# EAGLE board reg-board-1 (EAGLE 7.7.0), part 1 of 2
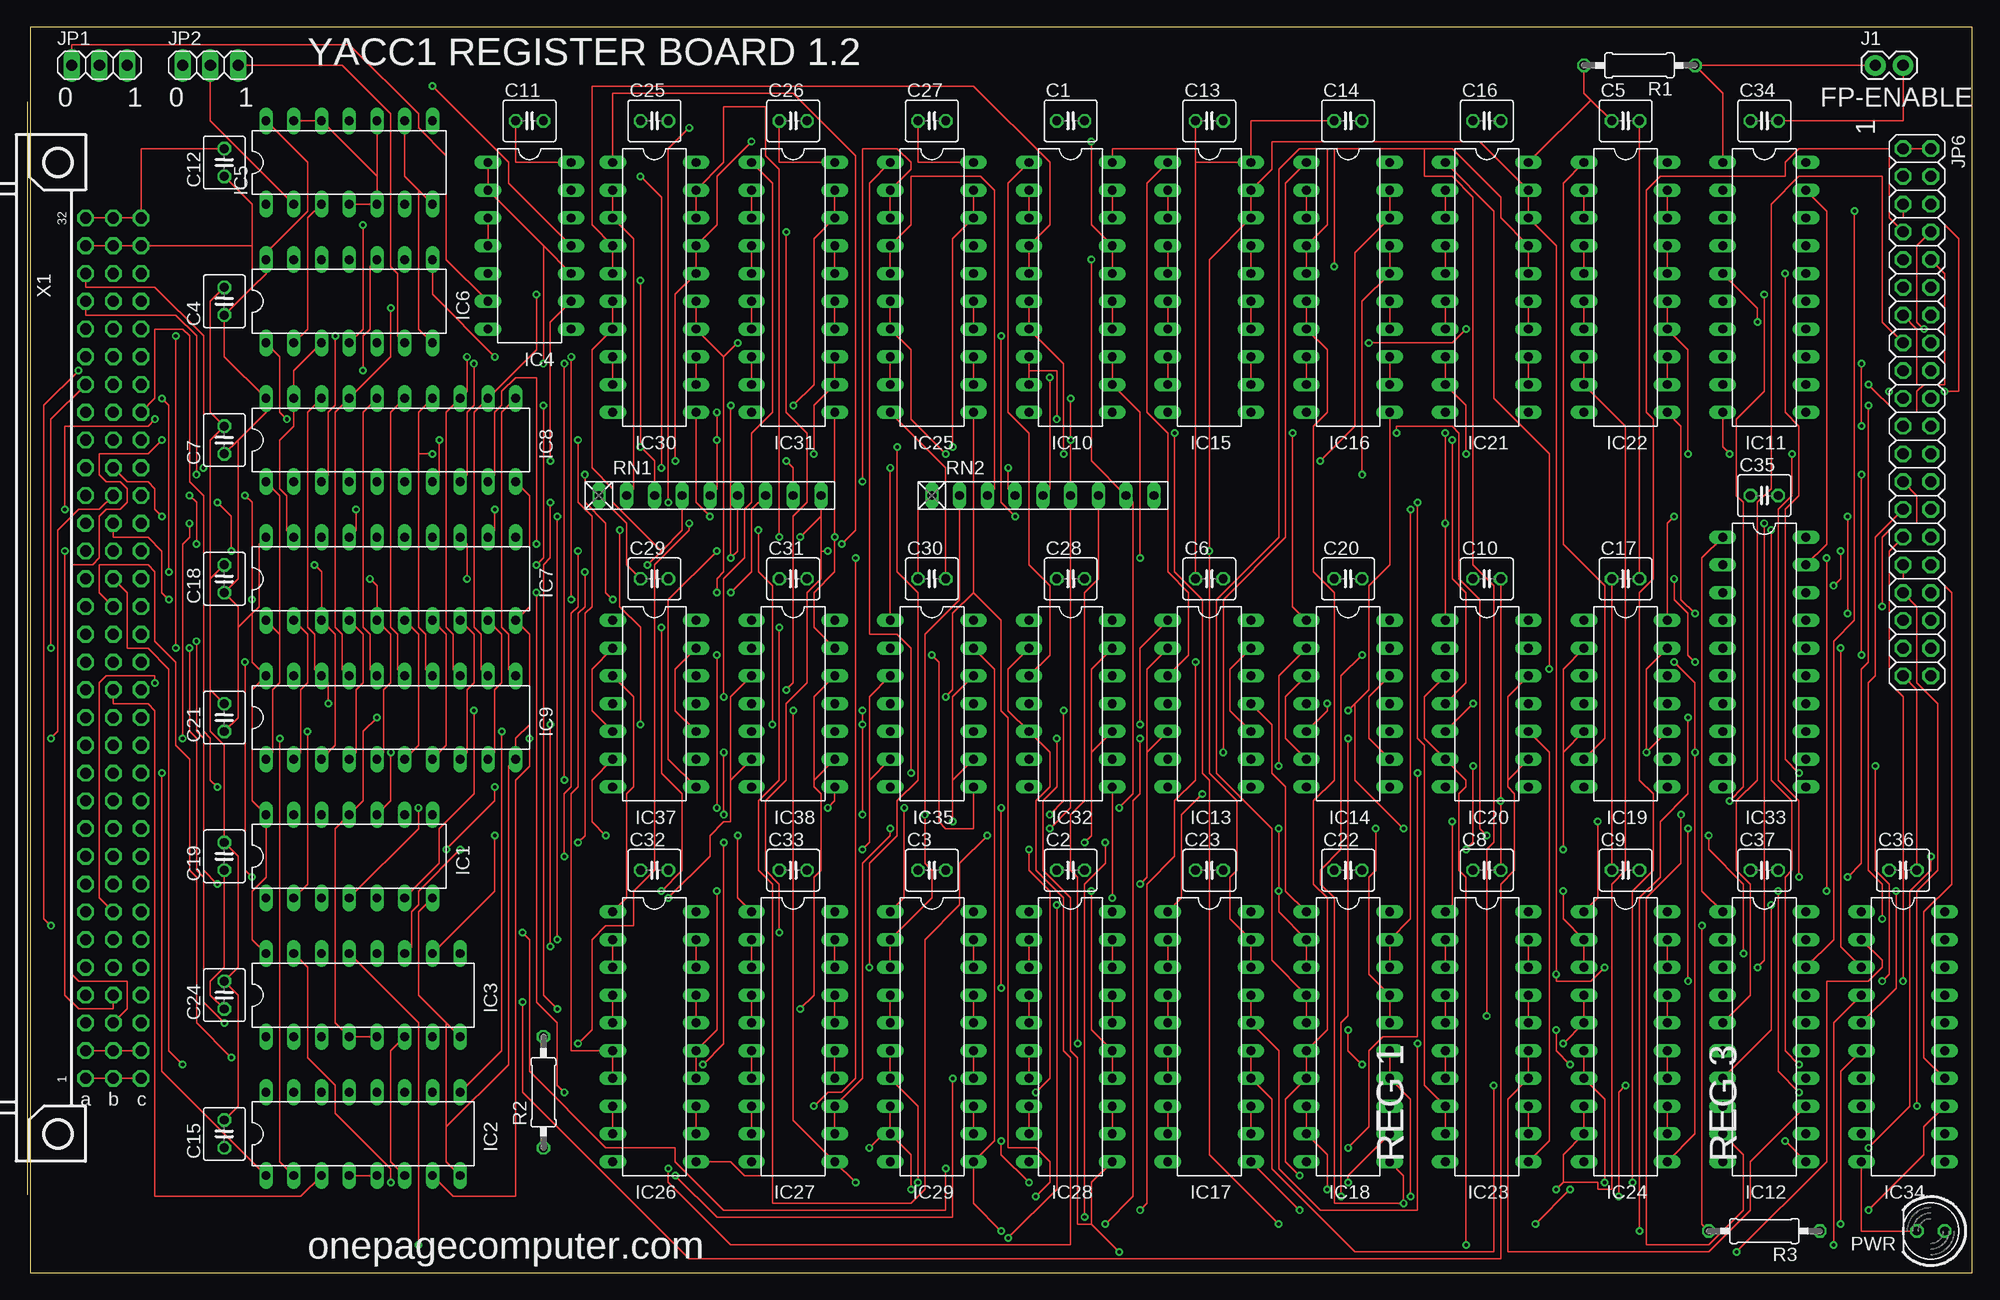
[diagram p5: board, top side]
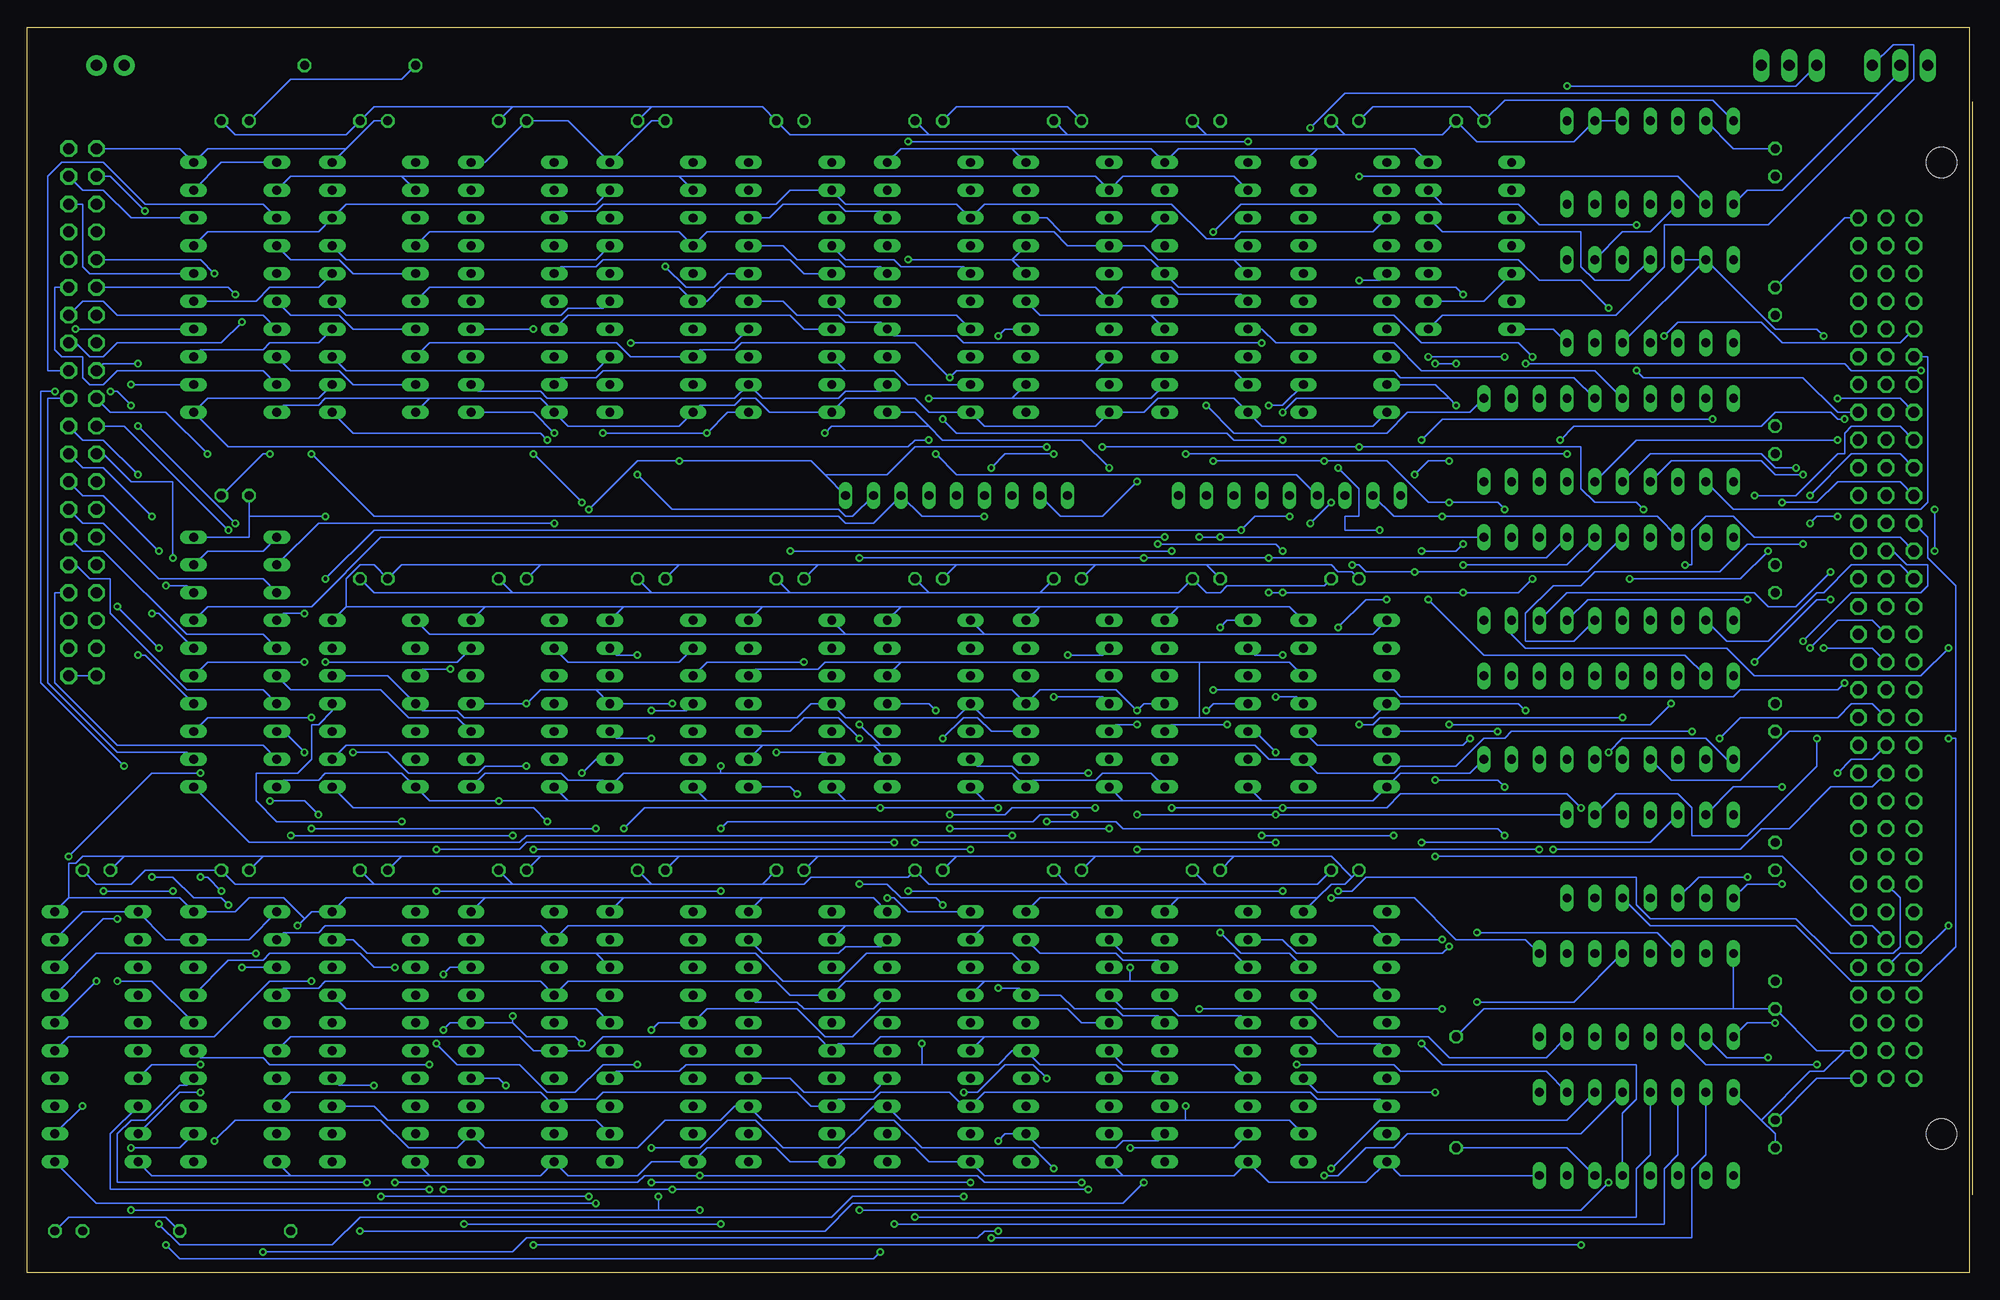
[diagram p6: board, bottom side, seen from below]

Size 177.78 x 113.97 mm. Coordinates in mm from the lower left corner, seen from the top.
Outline: 0,0 177.78,0 177.78,113.97 0,113.97 0,0
Copper layers (1*16): Top 0.0356mm / dielectric 1.5011mm / Bottom 0.0356mm
Design rules "LaenPCBOrder *": minimum track width 6mil, minimum drill 13mil, track to track 8mil, track to pad 8mil, pad to pad 8mil, via to via 8mil, smd to smd 6mil, copper to edge 40mil, drill to drill 8mil, minimum pad ring 7mil, minimum via ring 7mil, stop-mask expansion 3mil, vias tented up to drill 0mil, thermal gap 10mil
Net classes: 1 GND: width 1 mm; 2 5V: width 1 mm

## Footprints (pad centres in the part's own frame; a part is rotated, then mirrored left to right if it is on the bottom)
C025-040X050 = drill 0.813 octagon: 1 -1.27,0; 2 1.27,0
DIL14 = drill 0.813 long: 1 -7.62,-3.81; 2 -5.08,-3.81; 3 -2.54,-3.81; 4 0,-3.81; 5 2.54,-3.81; 6 5.08,-3.81; 7 7.62,-3.81; 8 7.62,3.81; 9 5.08,3.81; 10 2.54,3.81; 11 0,3.81; 12 -2.54,3.81; 13 -5.08,3.81; 14 -7.62,3.81
DIL16 = drill 0.813 long: 1 -8.89,-3.81; 2 -6.35,-3.81; 3 -3.81,-3.81; 4 -1.27,-3.81; 5 1.27,-3.81; 6 3.81,-3.81; 7 6.35,-3.81; 8 8.89,-3.81; 9 8.89,3.81; 10 6.35,3.81; 11 3.81,3.81; 12 1.27,3.81; 13 -1.27,3.81; 14 -3.81,3.81; 15 -6.35,3.81; 16 -8.89,3.81
DIL20 = drill 0.813 long: 1 -11.43,-3.81; 2 -8.89,-3.81; 3 -6.35,-3.81; 4 -3.81,-3.81; 5 -1.27,-3.81; 6 1.27,-3.81; 7 3.81,-3.81; 8 6.35,-3.81; 9 8.89,-3.81; 10 11.43,-3.81; 11 11.43,3.81; 12 8.89,3.81; 13 6.35,3.81; 14 3.81,3.81; 15 1.27,3.81; 16 -1.27,3.81; 17 -3.81,3.81; 18 -6.35,3.81; 19 -8.89,3.81; 20 -11.43,3.81
1X02 = drill 1.016 pad 1.88: 1 0,0; 2 2.54,0
1X03 = drill 1.016 long: 1 -2.54,0; 2 0,0; 3 2.54,0
2X20 = drill 1.016 octagon: 1 -24.13,-1.27; 2 -24.13,1.27; 3 -21.59,-1.27; 4 -21.59,1.27; 5 -19.05,-1.27; 6 -19.05,1.27; 7 -16.51,-1.27; 8 -16.51,1.27; 9 -13.97,-1.27; 10 -13.97,1.27; 11 -11.43,-1.27; 12 -11.43,1.27; 13 -8.89,-1.27; 14 -8.89,1.27; 15 -6.35,-1.27; 16 -6.35,1.27; 17 -3.81,-1.27; 18 -3.81,1.27; 19 -1.27,-1.27; 20 -1.27,1.27; 21 1.27,-1.27; 22 1.27,1.27; 23 3.81,-1.27; 24 3.81,1.27; 25 6.35,-1.27; 26 6.35,1.27; 27 8.89,-1.27; 28 8.89,1.27; 29 11.43,-1.27; 30 11.43,1.27; 31 13.97,-1.27; 32 13.97,1.27; 33 16.51,-1.27; 34 16.51,1.27; 35 19.05,-1.27; 36 19.05,1.27; 37 21.59,-1.27; 38 21.59,1.27; 39 24.13,-1.27; 40 24.13,1.27
LED5MM = drill 0.813 octagon: A -1.27,0; K 1.27,0
0207/10 = drill 0.813 octagon: 1 -5.08,0; 2 5.08,0
RN-9 = drill 0.813 long: 1 -10.16,0; 2 -7.62,0; 3 -5.08,0; 4 -2.54,0; 5 0,0; 6 2.54,0; 7 5.08,0; 8 7.62,0; 9 10.16,0
FABC96R = drill 1.016 octagon: A1 -2.54,39.37; A2 -2.54,36.83; A3 -2.54,34.29; A4 -2.54,31.75; A5 -2.54,29.21; A6 -2.54,26.67; A7 -2.54,24.13; A8 -2.54,21.59; A9 -2.54,19.05; A10 -2.54,16.51; A11 -2.54,13.97; A12 -2.54,11.43; A13 -2.54,8.89; A14 -2.54,6.35; A15 -2.54,3.81; A16 -2.54,1.27; A17 -2.54,-1.27; A18 -2.54,-3.81; A19 -2.54,-6.35; A20 -2.54,-8.89; A21 -2.54,-11.43; A22 -2.54,-13.97; A23 -2.54,-16.51; A24 -2.54,-19.05; A25 -2.54,-21.59; A26 -2.54,-24.13; A27 -2.54,-26.67; A28 -2.54,-29.21; A29 -2.54,-31.75; A30 -2.54,-34.29; A31 -2.54,-36.83; A32 -2.54,-39.37; B1 -5.08,39.37; B2 -5.08,36.83; B3 -5.08,34.29; B4 -5.08,31.75; B5 -5.08,29.21; B6 -5.08,26.67; B7 -5.08,24.13; B8 -5.08,21.59; B9 -5.08,19.05; B10 -5.08,16.51; B11 -5.08,13.97; B12 -5.08,11.43; B13 -5.08,8.89; B14 -5.08,6.35; B15 -5.08,3.81; B16 -5.08,1.27; B17 -5.08,-1.27; B18 -5.08,-3.81; B19 -5.08,-6.35; B20 -5.08,-8.89; B21 -5.08,-11.43; B22 -5.08,-13.97; B23 -5.08,-16.51; B24 -5.08,-19.05; B25 -5.08,-21.59; B26 -5.08,-24.13; B27 -5.08,-26.67; B28 -5.08,-29.21; B29 -5.08,-31.75; B30 -5.08,-34.29; B31 -5.08,-36.83; B32 -5.08,-39.37; C1 -7.62,39.37; C2 -7.62,36.83; C3 -7.62,34.29; C4 -7.62,31.75; C5 -7.62,29.21; C6 -7.62,26.67; C7 -7.62,24.13; C8 -7.62,21.59; C9 -7.62,19.05; C10 -7.62,16.51; C11 -7.62,13.97; C12 -7.62,11.43; C13 -7.62,8.89; C14 -7.62,6.35; C15 -7.62,3.81; C16 -7.62,1.27; C17 -7.62,-1.27; C18 -7.62,-3.81; C19 -7.62,-6.35; C20 -7.62,-8.89; C21 -7.62,-11.43; C22 -7.62,-13.97; C23 -7.62,-16.51; C24 -7.62,-19.05; C25 -7.62,-21.59; C26 -7.62,-24.13; C27 -7.62,-26.67; C28 -7.62,-29.21; C29 -7.62,-31.75; C30 -7.62,-34.29; C31 -7.62,-36.83; C32 -7.62,-39.37 | hole 2.794: 0,-44.456; 0,44.456

## Placement (x,y rotation side)
C1  [C025-040X050]  95.25,105.41 0 top
C2  [C025-040X050]  95.25,36.83 0 top
C3  [C025-040X050]  82.55,36.83 0 top
C4  [C025-040X050]  17.78,88.9 90 top
C5  [C025-040X050]  146.05,105.41 0 top
C6  [C025-040X050]  107.95,63.5 0 top
C7  [C025-040X050]  17.78,76.2 90 top
C8  [C025-040X050]  133.35,36.83 0 top
C9  [C025-040X050]  146.05,36.83 0 top
C10  [C025-040X050]  133.35,63.5 0 top
C11  [C025-040X050]  45.72,105.41 0 top
C12  [C025-040X050]  17.78,101.6 90 top
C13  [C025-040X050]  107.95,105.41 0 top
C14  [C025-040X050]  120.65,105.41 0 top
C15  [C025-040X050]  17.78,12.7 90 top
C16  [C025-040X050]  133.35,105.41 0 top
C17  [C025-040X050]  146.05,63.5 0 top
C18  [C025-040X050]  17.78,63.5 90 top
C19  [C025-040X050]  17.78,38.1 90 top
C20  [C025-040X050]  120.65,63.5 0 top
C21  [C025-040X050]  17.78,50.8 90 top
C22  [C025-040X050]  120.65,36.83 0 top
C23  [C025-040X050]  107.95,36.83 0 top
C24  [C025-040X050]  17.78,25.4 90 top
C25  [C025-040X050]  57.15,105.41 0 top
C26  [C025-040X050]  69.85,105.41 0 top
C27  [C025-040X050]  82.55,105.41 0 top
C28  [C025-040X050]  95.25,63.5 0 top
C29  [C025-040X050]  57.15,63.5 0 top
C30  [C025-040X050]  82.55,63.5 0 top
C31  [C025-040X050]  69.85,63.5 0 top
C32  [C025-040X050]  57.15,36.83 0 top
C33  [C025-040X050]  69.85,36.83 0 top
C34  [C025-040X050]  158.75,105.41 0 top
C35  [C025-040X050]  158.75,71.12 0 top
C36  [C025-040X050]  171.45,36.83 0 top
C37  [C025-040X050]  158.75,36.83 0 top
IC1  74LS04N  [DIL14]  29.21,38.1 0 top
IC2  74LS138N  [DIL16]  30.48,12.7 0 top
IC3  74LS138N  [DIL16]  30.48,25.4 0 top
IC4  74LS00N  [DIL14]  45.72,93.98 270 top
IC5  74LS86N  [DIL14]  29.21,101.6 0 top
IC6  74LS00N  [DIL14]  29.21,88.9 0 top
IC7  74LS245N  [DIL20]  33.02,63.5 0 top
IC8  74LS245N  [DIL20]  33.02,76.2 0 top
IC9  74LS245N  [DIL20]  33.02,50.8 0 top
IC10  74S374N  [DIL20]  95.25,90.17 270 top
IC11  74LS244N  [DIL20]  158.75,90.17 270 top
IC12  74LS244N  [DIL20]  158.75,21.59 270 top
IC13  7432N  [DIL14]  107.95,52.07 270 top
IC14  74LS02N  [DIL14]  120.65,52.07 270 top
IC15  74S374N  [DIL20]  107.95,90.17 270 top
IC16  74S374N  [DIL20]  120.65,90.17 270 top
IC17  74S374N  [DIL20]  107.95,21.59 270 top
IC18  74S374N  [DIL20]  120.65,21.59 270 top
IC19  7432N  [DIL14]  146.05,52.07 270 top
IC20  74LS02N  [DIL14]  133.35,52.07 270 top
IC21  74S374N  [DIL20]  133.35,90.17 270 top
IC22  74S374N  [DIL20]  146.05,90.17 270 top
IC23  74S374N  [DIL20]  133.35,21.59 270 top
IC24  74S374N  [DIL20]  146.05,21.59 270 top
IC25  74S374N  [DIL20]  82.55,90.17 270 top
IC26  74S374N  [DIL20]  57.15,21.59 270 top
IC27  74S374N  [DIL20]  69.85,21.59 270 top
IC28  74S374N  [DIL20]  95.25,21.59 270 top
IC29  74S374N  [DIL20]  82.55,21.59 270 top
IC30  74S374N  [DIL20]  57.15,90.17 270 top
IC31  74S374N  [DIL20]  69.85,90.17 270 top
IC32  7432N  [DIL14]  95.25,52.07 270 top
IC33  74LS244N  [DIL20]  158.75,55.88 270 top
IC34  74LS244N  [DIL20]  171.45,21.59 270 top
IC35  74LS02N  [DIL14]  82.55,52.07 270 top
IC37  7432N  [DIL14]  57.15,52.07 270 top
IC38  74LS02N  [DIL14]  69.85,52.07 270 top
J1  [1X02]  168.91,110.49 0 top
JP1  [1X03]  6.35,110.49 0 top
JP2  [1X03]  16.51,110.49 0 top
JP6  [2X20]  172.72,78.74 270 top
PWR  l1  [LED5MM]  173.99,3.81 180 top
R1  10k  [0207/10]  147.32,110.49 180 top
R2  10k  [0207/10]  46.99,16.51 90 top
R3  330  [0207/10]  158.75,3.81 180 top
RN1  [RN-9]  62.23,71.12 0 top
RN2  [RN-9]  92.71,71.12 0 top
X1  FABC96R  [FABC96R]  2.54,57.15 180 top

## Tracks (layer width: path | path; a pad name or v marks a point on that pad's centre or on a via)
-R0-RDSEL  (via drill 0.33)
  Top 0.152: v89.53,3.17 93.98,7.62 v93.98,33.66 | v101.6,35.56 102.23,36.2 102.23,47.62 | IC13.5 102.23,47.62 | IC13.2 102.23,55.24 102.23,47.62
  Bottom 0.152: IC2.15 24.13,10.79 25.4,9.53 25.4,3.17 v89.53,3.17 | v93.98,33.66 94.61,34.29 97.79,34.29 99.06,35.56 v101.6,35.56
-R0-WRSEL  (via drill 0.33)
  Top 0.152: IC3.15 25.4,27.94 25.4,19.68 27.94,17.14 27.94,14.61 33.02,9.53 v33.02,8.26 | v101.6,5.71 102.23,6.35 102.23,35.56 104.78,38.1 104.78,43.18 106.68,45.09 v106.68,55.88 | IC14.6 114.94,48.9 114.94,52.7 IC14.3
  Bottom 0.152: v33.02,8.26 35.56,5.71 v101.6,5.71 | v106.68,55.88 115.57,55.88 IC14.3
-R1-RDSEL  (via drill 0.33)
  Top 0.152: v98.42,4.45 100.97,6.99 100.97,43.18 101.6,43.81 v101.6,48.9 | IC13.13 109.86,55.24 109.86,51.44 IC13.10
  Bottom 0.152: IC2.14 26.67,10.79 27.94,9.53 27.94,4.45 v98.42,4.45 | v101.6,48.9 103.5,50.8 106.68,50.8 107.95,49.53 IC13.10
-R1-WRSEL  (via drill 0.33)
  Top 0.152: v45.09,31.11 45.72,30.48 45.72,18.41 52.7,11.43 59.05,11.43 59.05,10.16 63.5,5.71 83.82,5.71 v83.82,9.53 | v120.65,11.43 122.56,13.34 122.56,20.32 123.83,21.59 127,21.59 v127,45.72 | IC14.12 122.56,52.7 122.56,48.9 IC14.9
  Bottom 0.152: IC3.14 28.57,31.11 v45.09,31.11 | v83.82,9.53 85.72,11.43 95.89,11.43 98.42,13.97 100.97,13.97 103.5,11.43 108.58,11.43 111.12,13.97 113.67,13.97 116.2,11.43 v120.65,11.43 | v127,45.72 125.73,46.99 IC14.9
-R2-RDSEL  (via drill 0.33)
  Top 0.152: v96.52,5.08 96.52,35.56 98.42,37.47 v98.42,39.37 | 140.34,47.62 v140.34,38.73 | IC19.5 140.34,47.62 | IC19.2 140.34,55.24 140.34,47.62
  Bottom 0.152: IC2.13 29.21,10.79 30.48,9.53 30.48,5.08 v96.52,5.08 | v98.42,39.37 132.08,39.37 132.72,38.73 v140.34,38.73
-R2-WRSEL  (via drill 0.33)
  Top 0.152: IC3.13 35.56,22.86 v35.56,2.54 | v131.44,2.54 131.44,36.2 130.81,36.83 130.81,43.81 131.44,44.45 131.44,45.09 IC20.6 127.64,48.9 127.64,52.7 IC20.3
  Bottom 0.152: v131.44,2.54 v35.56,2.54
-R3-RDSEL  (via drill 0.33)
  Top 0.152: v59.05,8.89 62.87,5.08 84.45,5.08 v84.45,17.78 | v92.08,16.51 93.34,17.78 93.34,34.92 91.44,36.83 v91.44,38.73 | v131.44,38.73 132.08,39.37 v132.08,46.35 | IC19.10 v147.96,47.62 147.96,55.24 IC19.13
  Bottom 0.152: IC2.12 35.56,12.7 51.44,12.7 52.7,11.43 55.24,11.43 57.78,8.89 v59.05,8.89 | v84.45,17.78 85.72,19.05 88.27,19.05 90.81,16.51 v92.08,16.51 | v131.44,38.73 v91.44,38.73 | v132.08,46.35 135.89,46.35 136.53,45.72 142.88,45.72 144.78,47.62 v147.96,47.62
-R3-WRSEL  (via drill 0.33)
  Top 0.152: v45.09,24.77 45.09,16.51 60.33,1.27 134.62,1.27 134.62,35.56 135.89,36.83 135.89,43.81 135.25,44.45 135.25,45.09 | IC20.9 135.25,45.09 | IC20.12 135.25,52.7 135.25,45.09
  Bottom 0.152: IC3.12 36.2,24.77 v45.09,24.77
-R4-RDSEL  (via drill 0.33)
  Top 0.152: v58.42,9.53 58.42,8.26 64.14,2.54 95.25,2.54 95.25,19.68 94.61,20.32 94.61,34.29 92.08,36.83 92.08,43.18 93.34,44.45 93.34,47.62 IC32.5 89.53,51.44 89.53,55.24 IC32.2
  Bottom 0.152: IC2.11 36.83,13.97 53.98,13.97 v58.42,9.53
-R4-WRSEL  (via drill 0.33)
  Top 0.152: IC3.11 34.92,29.84 34.92,33.02 35.56,33.66 35.56,34.92 v39.37,38.73 | v76.2,38.73 76.83,39.37 76.83,45.09 | IC35.6 76.83,45.09 | IC35.3 76.83,52.7 76.83,45.09
  Bottom 0.152: v76.2,38.73 v39.37,38.73
-R5-RDSEL  (via drill 0.33)
  Top 0.152: v61.59,19.05 63.5,20.95 v63.5,39.37 | v96.52,39.37 97.16,40.01 97.16,47.62 | IC32.10 97.16,47.62 | IC32.13 97.16,55.24 97.16,47.62
  Bottom 0.152: IC2.10 38.73,18.41 52.07,18.41 52.7,19.05 v61.59,19.05 | v96.52,39.37 v63.5,39.37
-R5-WRSEL  (via drill 0.33)
  Top 0.152: IC3.10 42.55,34.92 v42.55,40.01 | 84.45,45.09 v84.45,41.27 | IC35.9 84.45,45.09 | IC35.12 84.45,52.7 84.45,45.09
  Bottom 0.152: v42.55,40.01 43.18,40.64 77.47,40.64 78.11,41.27 v84.45,41.27
-R6-RDSEL  (via drill 0.33)
  Top 0.152: IC2.9 43.18,20.32 v43.18,49.53 | IC37.2 51.44,55.24 51.44,51.44 IC37.5
  Bottom 0.152: IC37.5 v43.18,49.53
-R6-WRSEL  (via drill 0.33)
  Top 0.152: v58.42,34.29 62.23,38.1 62.23,40.01 63.5,41.27 64.14,41.27 64.14,45.09 | IC38.6 64.14,45.09 | IC38.3 64.14,52.7 64.14,45.09
  Bottom 0.152: IC3.9 40.64,30.48 46.99,30.48 50.8,34.29 v58.42,34.29
-R7-RDSEL  (via drill 0.33)
  Top 0.152: IC2.7 38.73,6.99 44.45,6.99 44.45,45.09 45.72,46.35 v45.72,48.9 | IC37.13 59.05,55.24 59.05,51.44 IC37.10
  Bottom 0.152: v45.72,48.9 46.35,48.26 59.69,48.26 IC37.10
-R7-WRSEL  (via drill 0.33)
  Top 0.152: v70.48,24.13 71.75,25.4 71.75,36.2 72.39,36.83 72.39,43.81 71.75,44.45 71.75,45.09 | IC38.9 71.75,45.09 | IC38.12 71.75,52.7 71.75,45.09
  Bottom 0.152: IC3.7 38.73,19.68 47.62,19.68 49.53,21.59 57.78,21.59 60.33,24.13 v70.48,24.13
-RDSEL  (via drill 0.33)
  Top 0.152: IC2.5 IC2.4 | v50.16,20.95 51.44,22.23 51.44,30.48 52.7,31.75 55.24,31.75 55.24,34.92 57.15,36.83 57.15,64.77 60.33,67.94 v60.33,68.58 | v58.42,70.48 58.42,102.87 v60.33,104.78
  Bottom 0.152: IC5.1 20.32,99.06 17.14,99.06 8.26,107.95 | 8.26,107.95 6.35,109.86 JP1.2 | IC2.5 31.75,14.61 30.48,15.88 30.48,19.05 48.26,19.05 v50.16,20.95 | v58.42,70.48 v60.33,68.58 | v60.33,104.78 57.15,107.95 8.26,107.95
-RLDH  (via drill 0.33)
  Top 0.152: v63.5,47.62 v63.5,41.91 | v76.2,51.44 v76.2,50.16 v76.2,41.91 | IC14.5 118.75,51.44 v118.75,52.07 | v132.08,52.07 IC20.5
  Bottom 0.152: IC1.8 v63.5,41.91 v76.2,41.91 | v63.5,47.62 65.41,49.53 IC38.5 | IC35.5 78.11,50.16 v76.2,50.16 | IC38.11 75.56,52.07 v76.2,51.44 78.11,53.34 85.09,53.34 IC35.11 87.63,53.34 125.73,53.34 | v118.75,52.07 IC14.11 125.73,53.34 | IC20.11 v132.08,52.07 130.81,53.34 125.73,53.34
-RLDL  (via drill 0.33)
  Top 0.152: IC1.4 35.56,40.64 v35.56,42.55 | v73.03,42.55 73.66,43.18 IC38.8 | v62.87,42.55 v62.87,56.52 | v82.55,56.52 83.19,55.88 83.19,41.27 83.82,40.64 86.36,40.64 IC35.8 | IC14.2 114.3,54.61 v114.3,46.35
  Bottom 0.152: IC14.2 118.11,55.88 128.27,55.88 IC20.2 | IC20.8 135.89,45.72 128.91,45.72 128.27,45.09 125.09,45.09 IC14.8 123.19,45.72 114.3,45.72 | v35.56,42.55 36.83,43.81 52.07,43.81 53.34,42.55 v62.87,42.55 v73.03,42.55 | IC38.8 74.93,45.72 79.38,45.72 80.01,45.09 85.72,45.09 IC35.8 87.63,45.72 114.3,45.72 | IC38.2 65.41,56.52 v62.87,56.52 | IC35.2 79.38,56.52 v82.55,56.52 | 114.3,45.72 v114.3,46.35
-RRDH  (via drill 0.33)
  Top 0.152: IC1.6 37.47,37.47 37.47,40.64 40.64,43.81 v40.64,51.44
  Bottom 0.152: IC19.12 144.78,54.61 IC19.4 141.6,51.44 138.43,51.44 137.79,50.8 107.31,50.8 106.05,52.07 IC13.4 102.87,50.8 92.71,50.8 IC32.4 90.17,50.8 70.48,50.8 | v40.64,51.44 41.27,52.07 IC37.4 54.61,50.8 70.48,50.8 | IC37.12 62.23,55.88 70.48,55.88 | 97.79,55.88 70.48,55.88 | IC32.12 97.79,55.88 | IC13.12 111.12,55.24 105.41,55.24 104.78,55.88 97.79,55.88 | 70.48,55.88 70.48,50.8
-RRDL  (via drill 0.33)
  Top 0.152: IC1.2 25.4,35.56 v25.4,49.53 | IC13.1 101.6,57.15 v101.6,50.16
  Bottom 0.152: IC37.1 54.61,58.42 90.17,58.42 | IC32.1 90.17,58.42 | 102.87,58.42 IC13.1 | 90.17,58.42 102.87,58.42 | IC19.1 140.97,58.42 102.87,58.42 | v25.4,49.53 41.91,49.53 42.55,48.9 44.45,48.9 46.99,46.35 52.07,46.35 52.7,45.72 59.69,45.72 IC37.9 64.14,46.99 65.41,48.26 99.69,48.26 | 100.33,48.26 IC32.9 | 110.49,48.26 100.33,48.26 | IC13.9 110.49,48.26 | IC19.9 148.59,48.26 110.49,48.26 | 100.33,48.26 99.69,48.26 | 99.69,48.26 v101.6,50.16
-WRSEL  (via drill 0.33)
  Top 0.152: IC5.2 16.51,105.41 JP2.2 | IC3.5 IC3.4 27.94,22.86 27.94,40.64 IC1.11 30.48,43.18 30.48,49.53 v31.75,50.8 | v55.88,100.33 57.78,98.42 v57.78,73.66 | v53.98,67.94 53.98,60.96 55.88,59.05 v55.88,50.16
  Bottom 0.152: IC5.2 26.67,100.33 v55.88,100.33 | v57.78,73.66 55.88,71.75 55.88,69.22 57.15,69.22 57.15,67.94 v53.98,67.94 | v55.88,50.16 54.61,50.16 53.98,50.8 v31.75,50.8
ADATA0  (via drill 0.33)
  Top 0.152: IC23.2 IC23.3 | IC17.2 IC17.3 | IC26.2 IC26.3 | IC28.2 IC28.3 | IC21.2 IC21.3 | IC10.2 IC10.3 | IC15.2 IC15.3 | IC30.2 IC30.3 55.24,94.61 55.24,71.75 RN1.2 | v48.26,69.22 v48.26,30.48
  Bottom 0.152: IC12.2 154.31,31.11 151.13,31.11 150.5,31.75 130.81,31.75 IC23.2 128.27,31.75 102.87,31.75 | 90.17,31.75 54.61,31.75 IC26.2 v48.26,30.48 | IC28.2 90.17,31.75 | 102.87,31.75 IC17.2 | 90.17,31.75 102.87,31.75 | IC21.3 128.91,97.16 125.73,97.16 125.09,97.79 109.22,97.79 107.95,99.06 IC15.2 102.87,97.79 92.71,97.79 IC10.3 90.17,97.79 73.03,97.79 69.85,94.61 67.31,94.61 66.67,95.25 54.61,95.25 IC30.3 | IC7.18 28.57,69.22 v48.26,69.22 52.7,69.22 RN1.2
ADATA1  (via drill 0.33)
  Top 0.152: IC23.4 IC23.5 | IC17.4 IC17.5 | IC26.4 IC26.5 | IC28.4 IC28.5 | IC21.4 IC21.5 | IC10.5 IC10.4 93.34,95.89 93.34,101.6 86.36,108.58 51.44,108.58 51.44,95.89 IC30.4 IC30.5 | IC15.4 IC15.5 | IC7.17 29.84,67.94 v29.84,69.85 | RN1.3 57.15,74.3 v55.88,75.56 v55.88,90.81 | v76.83,27.94 76.83,37.47 79.38,40.01 79.38,43.18 81.28,45.09 81.28,62.23 79.38,64.14 v79.38,75.56
  Bottom 0.152: IC12.4 154.31,26.04 151.13,26.04 150.5,26.67 130.81,26.67 IC23.4 128.27,26.67 109.22,26.67 107.95,25.4 IC17.4 102.87,26.67 90.17,26.67 | IC26.4 54.61,26.67 76.83,26.67 | 90.17,26.67 76.83,26.67 | IC28.4 90.17,26.67 | IC10.5 92.08,92.08 97.79,92.08 98.42,92.71 102.87,92.71 IC15.4 | IC21.5 128.91,92.08 125.73,92.08 125.09,92.71 107.95,92.71 106.68,91.44 IC15.5 | v29.84,69.85 30.48,70.48 34.29,70.48 35.56,71.75 35.56,75.56 v55.88,75.56 v79.38,75.56 | IC30.5 53.98,90.81 v55.88,90.81 | v76.83,27.94 76.83,26.67
ADATA2  (via drill 0.33)
  Top 0.152: IC23.6 IC23.7 | IC17.6 IC17.7 | IC26.7 IC26.6 49.53,20.32 49.53,43.81 50.16,44.45 50.16,60.33 50.8,60.96 v50.8,64.14 | IC28.6 IC28.7 | IC21.6 IC21.7 | IC10.6 IC10.7 94.61,83.19 v94.61,74.93 | IC15.6 IC15.7 | IC30.6 IC30.7 51.44,84.45 51.44,73.66 53.34,71.75 53.34,70.48 57.78,66.04 | 57.78,66.04 59.69,67.94 RN1.4 | 57.78,66.04 v56.52,64.77
  Bottom 0.152: IC12.6 153.67,21.59 132.72,21.59 131.44,20.32 IC23.6 126.36,20.32 125.09,21.59 105.41,21.59 IC17.6 103.5,20.95 100.33,20.95 99.69,21.59 90.17,21.59 | IC26.6 53.98,20.95 59.69,20.95 60.33,21.59 90.17,21.59 | IC28.6 90.17,21.59 | IC10.7 92.71,87.63 102.87,87.63 IC15.6 | IC21.7 128.27,87.63 107.95,87.63 106.68,86.36 IC15.7 | IC7.16 34.92,64.14 v50.8,64.14 55.24,64.14 55.88,64.77 v56.52,64.77 | v94.61,74.93 92.71,73.03 61.59,73.03 RN1.4
ADATA3  (via drill 0.33)
  Top 0.152: IC23.9 IC23.8 127.64,17.14 127.64,48.26 127,48.9 v127,70.48 | IC17.8 IC17.9 | IC26.8 IC26.9 | IC28.8 IC28.9 | IC21.8 IC21.9 131.44,79.38 v131.44,74.93 | IC10.8 91.44,82.55 | 91.44,82.55 IC10.9 | IC15.8 IC15.9 | v46.35,64.77 46.99,65.41 v46.99,79.38 | RN1.5 62.87,71.75 v62.87,76.2 v62.87,78.74 | IC30.9 IC30.8 | 91.44,82.55 93.98,82.55 v93.98,78.11
  Bottom 0.152: IC12.8 153.67,16.51 130.81,16.51 IC23.8 128.91,15.88 125.73,15.88 125.09,16.51 107.31,16.51 106.05,15.24 IC17.8 103.5,15.88 100.33,15.88 99.69,16.51 93.34,16.51 92.08,15.24 IC28.8 90.17,16.51 60.33,16.51 59.69,15.88 53.98,15.88 IC26.8 | IC10.9 97.16,81.28 98.42,82.55 102.87,82.55 | IC15.8 102.87,82.55 | IC21.9 128.91,81.92 125.73,81.92 125.09,82.55 102.87,82.55 | IC7.15 36.83,64.77 v46.35,64.77 | 47.62,80.01 48.9,81.28 IC30.9 | 47.62,80.01 v46.99,79.38 | v62.87,78.74 61.59,80.01 47.62,80.01 | v93.98,78.11 92.71,76.83 67.94,76.83 67.31,76.2 v62.87,76.2 | v131.44,74.93 v127,70.48
ADATA4  (via drill 0.33)
  Top 0.152: IC23.13 IC23.12 | v160.66,12.06 IC12.11 | IC17.13 IC17.12 | IC26.13 IC26.12 | IC28.13 IC28.12 | IC21.13 IC21.12 | IC10.13 IC10.12 101.6,78.74 v101.6,65.41 | IC15.13 IC15.12 | IC30.13 IC30.12 | RN1.6 64.77,66.04 v64.14,65.41 v64.14,79.38 | v71.75,15.24 73.03,16.51 74.3,16.51 75.56,17.78 v75.56,65.41
  Bottom 0.152: v160.66,12.06 158.75,13.97 145.41,13.97 142.88,11.43 138.43,11.43 IC23.12 135.89,11.43 121.92,11.43 119.38,13.97 114.3,13.97 113.03,15.24 IC17.13 110.49,13.97 101.6,13.97 100.33,15.24 IC28.13 97.79,13.97 71.75,13.97 | IC26.12 62.23,13.97 71.75,13.97 | IC10.12 99.69,80.64 102.87,80.64 103.5,80.01 110.49,80.01 IC15.12 113.03,80.01 130.18,80.01 130.81,80.64 136.53,80.64 IC21.12 | IC7.14 38.73,65.41 v64.14,65.41 v75.56,65.41 v101.6,65.41 | IC30.12 62.87,79.38 v64.14,79.38 | v71.75,15.24 71.75,13.97
ADATA5  (via drill 0.33)
  Top 0.152: IC28.14 IC28.15 97.16,22.23 v97.16,34.92 | IC17.15 IC17.14 113.67,15.88 113.67,9.53 121.28,1.91 133.99,1.91 v133.99,17.14 | IC23.15 IC23.14 135.25,15.88 135.25,1.91 153.67,1.91 157.48,5.71 157.48,10.16 IC12.13 | IC21.15 IC21.14 | IC10.15 IC10.14 | IC15.15 IC15.14 | v131.44,86.36 130.18,85.09 v122.56,85.09 | IC30.15 IC30.14 63.5,83.82 | IC26.14 IC26.15 62.87,22.23 v62.87,34.92 | IC7.13 40.01,66.67 v40.01,63.5 | v64.14,62.23 66.04,64.14 66.04,69.85 RN1.7 | v48.9,16.51 48.26,17.14 48.26,22.86 46.35,24.77 v46.35,62.23 | 63.5,83.82 63.5,64.14 62.87,63.5 v62.87,62.23 | 63.5,83.82 v64.77,85.09
  Bottom 0.152: IC28.14 100.33,16.51 106.68,16.51 107.95,17.78 IC17.14 | v133.99,17.14 134.62,17.78 IC23.14 | IC15.15 108.58,88.9 107.31,87.63 103.5,87.63 102.87,87 99.69,87 IC10.14 98.42,85.72 92.71,85.72 92.08,85.09 v64.77,85.09 | v131.44,86.36 IC21.14 | v122.56,85.09 113.03,85.09 IC15.14 | v40.01,63.5 41.27,62.23 v46.35,62.23 v62.87,62.23 v64.14,62.23 | IC26.14 59.69,16.51 v48.9,16.51 | v62.87,34.92 v97.16,34.92
ADATA6  (via drill 0.33)
  Top 0.152: IC28.17 IC28.16 | IC17.17 IC17.16 114.3,20.32 114.3,9.53 118.11,5.71 127,5.71 v127,20.95 | IC23.17 IC23.16 | v140.97,19.05 139.7,20.32 v139.7,22.23 | IC21.16 IC21.17 134.62,96.52 134.62,98.42 130.18,102.87 127.64,102.87 | IC10.16 IC10.17 97.16,95.89 v97.16,103.5 | IC15.17 IC15.16 | 127.64,102.87 119.38,102.87 v119.38,92.08 | IC26.17 IC26.16 | IC7.12 42.55,67.94 v42.55,69.85 | v69.22,74.3 69.85,73.66 RN1.8 | v48.26,24.13 46.99,25.4 46.99,64.77 47.62,65.41 v47.62,70.48 | v59.05,74.3 59.05,89.53 IC30.16 IC30.17 62.87,95.89 62.87,100.33 v66.04,103.5 | v133.35,23.5 133.35,38.73 133.99,39.37 133.99,62.87 132.08,64.77 132.08,98.42 130.18,100.33 127.64,100.33 127.64,102.87
  Bottom 0.152: IC28.17 100.33,24.13 106.68,24.13 107.31,24.77 111.12,24.77 IC17.17 | IC12.15 161.93,19.68 156.21,19.68 155.57,19.05 v140.97,19.05 | v139.7,22.23 139.06,22.86 IC23.16 133.35,22.86 | v127,20.95 127.64,21.59 132.08,21.59 133.35,22.86 | IC10.16 99.69,92.08 102.87,92.08 103.5,92.71 107.31,92.71 108.58,93.98 IC15.17 | v119.38,92.08 117.47,90.17 114.94,90.17 113.67,91.44 IC15.16 | v42.55,69.85 43.18,70.48 v47.62,70.48 49.53,70.48 53.34,74.3 v59.05,74.3 v69.22,74.3 | IC26.17 59.69,24.13 v48.26,24.13 | v66.04,103.5 v97.16,103.5 | v133.35,23.5 133.35,22.86
ADATA7  (via drill 0.33)
  Top 0.152: IC30.18 IC30.19 63.5,101.6 63.5,106.68 67.31,106.68 67.31,102.23 68.58,100.97 v68.58,67.31 | IC26.19 IC26.18 | 72.39,69.22 v70.48,67.31 | RN1.9 72.39,69.22 | v68.58,31.11 68.58,35.56 67.31,36.83 67.31,43.18 69.22,45.09 69.22,52.07 71.12,53.98 71.12,62.23 72.39,63.5 72.39,66.04 | 72.39,69.22 72.39,66.04 | IC23.19 IC23.18 | v144.15,27.94 142.88,26.67 139.7,26.67 v139.7,27.3 139.7,93.98 IC21.18 IC21.19 132.72,103.5 113.67,103.5 113.67,100.97 IC15.19 IC15.18 107.95,92.71 v107.95,66.04 107.95,45.72 110.49,43.18 110.49,36.83 109.86,36.2 109.86,32.38 IC17.19 IC17.18 | IC28.19 IC28.18 | IC10.19 IC10.18 | v73.03,66.04 72.39,66.04
  Bottom 0.152: v70.48,67.31 v68.58,67.31 IC7.11 | IC26.18 62.23,29.21 66.67,29.21 v68.58,31.11 | IC12.17 159.38,28.57 156.21,28.57 155.57,29.21 147.32,29.21 146.05,27.94 v144.15,27.94 | v139.7,27.3 139.06,27.94 IC23.18 | IC28.19 99.69,29.84 102.87,29.84 103.5,29.21 110.49,29.21 IC17.19 | IC10.18 99.69,97.16 102.87,97.16 103.5,97.79 108.58,97.79 109.86,96.52 IC15.18 | v107.95,66.04 v73.03,66.04
ADATA8  (via drill 0.33)
  Top 0.152: IC31.2 IC31.3 | IC25.3 IC25.2 80.64,100.97 80.64,101.6 79.38,102.87 76.2,102.87 v76.2,72.39 | IC16.2 IC16.3 | IC22.2 IC22.3 | IC18.3 IC18.2 114.3,33.02 v114.3,34.92 v114.3,40.64 | IC24.3 IC24.2 140.34,32.38 v140.34,34.92 | IC8.18 25.4,78.74 25.4,59.05 26.04,58.42 26.04,55.24 IC9.18 27.3,53.98 v27.3,52.07 | IC27.2 IC27.3 | IC29.3 IC29.2 82.55,34.29 82.55,36.83 81.92,37.47 v81.92,41.91 81.92,58.42 85.09,61.59 RN2.2 | v47.62,29.84 v47.62,50.16
  Bottom 0.152: IC31.2 67.31,100.33 77.47,100.33 IC25.2 80.01,100.33 118.11,100.33 | IC11.2 153.67,100.33 143.51,100.33 | IC22.2 143.51,100.33 | 118.11,100.33 IC16.2 | 143.51,100.33 118.11,100.33 | v140.34,34.92 v114.3,34.92 | IC27.3 67.31,29.21 77.47,29.21 IC29.2 | v27.3,52.07 29.21,50.16 v47.62,50.16 | v47.62,29.84 48.26,29.21 61.59,29.21 62.87,30.48 IC27.2 | v114.3,40.64 113.67,41.27 85.72,41.27 85.09,41.91 v81.92,41.91 | v76.2,72.39 79.38,69.22 83.19,69.22 RN2.2
ADATA9  (via drill 0.33)
  Top 0.152: IC24.4 IC24.5 v140.34,20.95 | IC18.5 IC18.4 113.67,28.57 113.67,40.64 108.58,45.72 108.58,61.59 114.3,67.31 114.3,100.97 116.2,102.87 118.75,102.87 118.75,95.89 IC16.4 IC16.5 | IC27.4 IC27.5 | IC29.4 IC29.5 | v121.92,19.05 120.65,20.32 v120.65,22.23 | IC22.4 IC22.5 | IC9.17 28.57,55.24 28.57,58.42 27.94,59.05 27.94,78.74 IC8.17 33.02,83.82 v33.02,88.27 | IC31.4 IC31.5 | IC25.5 IC25.4 80.64,95.89 80.64,100.33 87,100.33 88.27,99.06 88.27,71.75 RN2.3
  Bottom 0.152: IC27.5 66.67,23.5 72.39,23.5 73.03,24.13 77.47,24.13 IC29.4 | IC29.5 81.28,22.86 82.55,24.13 99.69,24.13 102.23,21.59 104.78,21.59 107.31,24.13 115.57,24.13 IC18.5 120.02,22.86 v120.65,22.23 | v140.34,20.95 138.43,19.05 132.72,19.05 130.18,16.51 127.64,16.51 125.09,19.05 v121.92,19.05 | IC11.4 153.67,92.71 149.22,92.71 147.96,91.44 IC22.5 | IC22.4 140.97,95.25 118.11,95.25 IC16.4 115.57,95.25 83.82,95.25 82.55,93.98 IC25.4 75.56,93.98 74.3,92.71 67.31,92.71 | 67.31,92.71 IC31.5 | v33.02,88.27 35.56,90.81 39.37,90.81 41.27,92.71 67.31,92.71
ADATA10  (via drill 0.33)
  Top 0.152: IC9.16 31.11,55.24 31.11,58.42 30.48,59.05 30.48,78.74 IC8.16 | IC31.6 IC31.7 | IC25.6 IC25.7 80.64,84.45 80.64,78.11 v83.82,74.93 | RN2.4 89.53,71.75 v89.53,73.66 | IC22.6 IC22.7 | IC27.6 IC27.7 | IC29.6 IC29.7 81.28,15.24 v81.28,8.26 | IC24.6 IC24.7 144.15,15.88 v144.15,8.26 | IC16.6 IC16.7 118.75,84.45 118.75,78.74 117.47,77.47 117.47,64.14 119.38,62.23 119.38,45.09 117.47,43.18 117.47,35.56 118.75,34.29 118.75,22.23 IC18.6 IC18.7 114.94,15.88 114.94,10.16 v116.2,8.89
  Bottom 0.152: v89.53,73.66 88.27,74.93 v83.82,74.93 | IC31.6 66.67,89.53 72.39,89.53 73.03,90.17 77.47,90.17 IC25.6 80.01,90.17 114.3,90.17 115.57,88.9 IC16.6 118.11,90.17 140.97,90.17 IC22.6 | IC8.16 34.29,82.55 50.16,82.55 52.7,85.09 63.5,85.09 64.77,86.36 IC31.7 | IC11.6 153.67,87.63 149.22,87.63 147.96,86.36 IC22.7 | IC27.7 67.31,19.05 77.47,19.05 IC29.6 | v144.15,8.26 121.92,8.26 121.28,8.89 v116.2,8.89 90.81,8.89 90.17,8.26 v81.28,8.26
ADATA11  (via drill 0.33)
  Top 0.152: IC27.8 IC27.9 | IC29.8 78.74,13.34 | 78.74,13.34 IC29.9 80.64,10.79 v80.64,7.62 | 78.74,13.34 v76.83,11.43 | IC18.8 IC18.9 118.75,10.79 v118.75,7.62 | IC24.8 IC24.9 140.34,10.79 140.34,8.26 | 140.34,8.26 v139.7,7.62 | IC9.15 33.66,55.24 33.66,58.42 33.02,59.05 33.02,78.74 IC8.15 | IC22.8 IC22.9 146.05,77.47 146.05,36.83 144.78,35.56 144.78,7.62 143.51,7.62 143.51,8.26 140.34,8.26 | IC16.8 IC16.9 | IC31.8 IC31.9 | IC25.8 IC25.9 | RN2.5 93.34,71.75 v93.34,81.92
  Bottom 0.152: IC27.9 67.31,11.43 v76.83,11.43 | v139.7,7.62 v118.75,7.62 v80.64,7.62 | IC11.8 153.67,82.55 149.22,82.55 147.96,81.28 IC22.9 | 80.01,82.55 92.71,82.55 v93.34,81.92 96.52,85.09 112.39,85.09 113.03,84.45 116.2,84.45 IC16.8 122.56,83.82 123.83,85.09 140.97,85.09 IC22.8 | IC25.8 80.01,82.55 | 67.31,82.55 IC31.9 | 80.01,82.55 67.31,82.55 | IC8.15 36.2,81.92 52.07,81.92 52.7,82.55 67.31,82.55
ADATA12  (via drill 0.33)
  Top 0.152: IC16.13 IC16.12 | IC22.13 IC22.12 | IC18.13 IC18.12 120.65,8.89 v120.65,8.26 | IC24.13 IC24.12 | IC9.14 36.2,55.24 36.2,58.42 35.56,59.05 35.56,74.93 | 35.56,74.93 35.56,78.74 IC8.14 | IC27.12 IC27.13 76.2,17.78 76.2,37.47 78.74,40.01 v78.74,40.64 | IC29.13 IC29.12 | IC31.13 IC31.12 71.75,79.38 v71.75,74.93 | v95.25,80.01 v95.25,76.2 RN2.6 95.25,42.55 v93.34,40.64 | IC25.12 IC25.13 | v36.83,74.93 35.56,74.93 | v91.44,8.26 88.9,10.79 v88.9,12.06
  Bottom 0.152: IC22.12 151.13,80.01 161.29,80.01 IC11.11 159.38,75.56 97.16,75.56 96.52,76.2 v95.25,76.2 | IC16.13 125.73,82.55 148.59,82.55 IC22.13 | IC18.12 125.73,13.97 144.78,13.97 146.05,15.24 IC24.13 | IC27.12 74.3,12.06 77.47,12.06 78.11,11.43 85.09,11.43 IC29.12 88.27,12.7 v88.9,12.06 | 87.63,80.01 v95.25,80.01 | IC25.12 87.63,80.01 | IC31.12 74.93,80.01 87.63,80.01 | v93.34,40.64 v78.74,40.64 | v71.75,74.93 v36.83,74.93 | v91.44,8.26 v120.65,8.26
ADATA13  (via drill 0.33)
  Top 0.152: IC24.15 IC24.14 | IC18.15 IC18.14 126.36,15.88 v126.36,6.99 | IC27.15 IC27.14 | IC29.15 IC29.14 | v146.05,17.14 145.41,16.51 v145.41,6.99 | IC16.15 IC16.14 | IC22.15 IC22.14 151.76,84.45 v151.76,74.93 | IC9.13 38.73,55.24 38.73,58.42 38.1,59.05 38.1,78.74 IC8.13 40.01,80.64 v40.01,83.82 | IC31.15 IC31.14 | v90.17,69.22 88.9,70.48 v88.9,85.72 | IC25.14 IC25.15 | v95.89,20.95 95.89,36.2 95.25,36.83 95.25,41.91 96.52,43.18 96.52,62.23 97.79,63.5 RN2.7
  Bottom 0.152: IC27.14 74.3,18.41 77.47,18.41 78.11,19.05 85.09,19.05 IC29.15 87.63,20.32 88.9,19.05 95.89,19.05 | IC18.14 123.83,18.41 118.11,18.41 117.47,19.05 95.89,19.05 | IC24.14 149.22,17.14 v146.05,17.14 | v126.36,6.99 v145.41,6.99 | IC11.13 161.93,84.45 156.21,84.45 155.57,85.09 151.13,85.09 IC22.14 | IC16.15 125.09,88.27 128.27,88.27 128.91,87.63 148.59,87.63 IC22.15 | v90.17,69.22 95.89,69.22 RN2.7 100.33,68.58 102.87,68.58 103.5,69.22 146.05,69.22 v151.76,74.93 | v88.9,85.72 88.27,86.36 IC25.14 | 74.93,87.63 IC31.14 | 74.93,87.63 85.09,87.63 IC25.15 | v40.01,83.82 41.27,85.09 50.16,85.09 52.7,87.63 74.93,87.63 | v95.89,20.95 95.89,19.05
ADATA14  (via drill 0.33)
  Top 0.152: IC16.17 IC16.16 121.92,88.9 v121.92,73.03 | IC22.17 IC22.16 | IC18.16 IC18.17 122.56,27.3 122.56,36.2 123.19,36.83 v123.19,40.64 | IC24.17 IC24.16 | IC9.12 41.27,55.24 41.27,58.42 40.64,59.05 40.64,78.74 IC8.12 46.35,84.45 v46.35,89.53 | IC27.17 IC27.16 | IC29.17 IC29.16 | IC31.17 IC31.16 | v97.16,92.71 97.16,74.3 RN2.8 100.97,70.48 100.97,43.81 v99.69,42.55 | v88.9,42.55 v88.9,26.04
  Bottom 0.152: IC11.15 156.84,88.9 155.57,90.17 151.13,90.17 IC22.16 | IC16.17 125.73,92.71 148.59,92.71 IC22.17 | IC18.16 125.73,24.13 148.59,24.13 IC24.17 | IC27.16 74.3,23.5 77.47,23.5 78.11,24.13 81.92,24.13 83.19,25.4 IC29.17 87,26.04 v88.9,26.04 | 87.63,92.71 v97.16,92.71 | IC25.17 87.63,92.71 | 87.63,92.71 IC25.16 | 87.63,92.71 74.93,92.71 IC31.16 72.39,90.17 46.99,90.17 v46.35,89.53 | v88.9,42.55 v99.69,42.55 121.28,42.55 v123.19,40.64 | v121.92,73.03 118.75,69.85 103.5,69.85 102.87,69.22 102.23,69.22 RN2.8
ADATA15  (via drill 0.33)
  Top 0.152: IC27.19 IC27.18 | IC29.19 IC29.18 | IC18.18 IC18.19 126.36,32.38 v126.36,69.85 | IC24.19 IC24.18 | IC9.11 43.81,55.24 43.81,58.42 43.18,59.05 43.18,78.74 IC8.11 | IC22.19 IC22.18 | IC31.19 IC31.18 71.75,94.61 71.75,81.28 v69.85,79.38 | IC25.19 IC25.18 84.45,94.61 v84.45,75.56 | v118.11,74.3 121.28,77.47 121.28,93.34 IC16.18 IC16.19
  Bottom 0.152: IC27.18 74.3,28.57 77.47,28.57 78.11,29.21 85.09,29.21 IC29.19 | 125.73,29.21 IC18.18 | 125.73,29.21 146.69,29.21 147.96,30.48 IC24.19 | IC29.18 87.63,29.21 100.97,29.21 103.5,26.67 108.58,26.67 111.12,29.21 125.73,29.21 | IC11.17 161.29,95.25 151.13,95.25 IC22.18 148.59,97.79 125.73,97.79 IC16.19 | IC31.18 74.93,95.25 83.19,95.25 84.45,96.52 IC25.18 | 104.78,73.03 106.05,74.3 v118.11,74.3 121.92,74.3 v126.36,69.85 | 104.78,73.03 RN2.9 | v84.45,75.56 96.52,75.56 99.06,73.03 104.78,73.03 | IC8.11 45.72,78.74 51.44,78.74 53.34,76.83 67.31,76.83 v69.85,79.38
BUS-DIR  (via drill 0.33)
  Top 0.152: IC9.1 22.23,47.62 22.23,53.34 22.86,53.98 22.86,58.42 | IC7.1 22.86,58.42 | IC8.1 22.86,71.12 22.86,58.42 | IC1.10 33.02,43.18 v33.02,47.62
  Bottom 0.152: v33.02,47.62 31.75,48.9 24.13,48.9 22.23,46.99 IC9.1
CLK0H  (via drill 0.33)
  Top 0.152: 121.28,52.07 122.56,53.34 122.56,62.87 124.46,64.77 IC16.11 | 121.28,52.07 v120.65,51.44 | v151.76,40.64 v151.76,26.67 | v125.73,40.64 121.28,45.09 121.28,52.07
  Bottom 0.152: IC14.4 117.47,51.44 v120.65,51.44 | IC34.15 173.99,21.59 160.66,21.59 155.57,26.67 v151.76,26.67 | v125.73,40.64 v151.76,40.64
CLK0L  (via drill 0.33)
  Top 0.152: IC14.1 115.57,60.96 v115.57,76.83 | v156.84,29.21 156.84,35.56 153.67,38.73 v153.67,40.01 | v133.35,40.01 132.72,40.64 132.72,61.59 130.81,63.5 130.81,76.83 130.18,77.47 125.09,77.47 v125.09,76.83
  Bottom 0.152: IC15.11 113.67,78.74 v115.57,76.83 v125.09,76.83 | IC34.17 171.45,29.21 v156.84,29.21 | v133.35,40.01 v153.67,40.01
CLK1H  (via drill 0.33)
  Top 0.152: IC18.11 125.73,8.89 v125.73,6.35 119.38,6.35 119.38,34.29 118.11,35.56 118.11,36.83 120.02,38.73 120.02,54.61 v121.92,56.52
  Bottom 0.152: v125.73,6.35 171.45,6.35 IC34.11 | IC14.13 123.83,56.52 v121.92,56.52
CLK1L  (via drill 0.33)
  Top 0.152: v116.2,5.71 IC17.11 | v168.28,5.71 173.35,10.79 173.35,13.34 IC34.13 | v120.65,48.9 120.65,23.5 120.02,22.86 v120.02,6.99
  Bottom 0.152: v168.28,5.71 120.02,5.71 | 120.02,5.71 v116.2,5.71 | IC14.10 123.83,48.9 v120.65,48.9 | 120.02,5.71 v120.02,6.99
CLK2H  (via drill 0.33)
  Top 0.152: IC20.4 131.44,53.98 131.44,62.23 130.18,63.5 v130.18,76.2 | v152.4,60.33 151.13,61.59 151.13,77.47 IC22.11
  Bottom 0.152: v130.18,76.2 130.81,76.83 147.96,76.83 IC22.11 | IC33.4 154.31,60.33 v152.4,60.33
CLK2L  (via drill 0.33)
  Top 0.152: v129.54,76.83 v129.54,68.58 IC20.1
  Bottom 0.152: v129.54,76.83 131.44,78.74 IC21.11 | IC33.2 151.13,68.58 v129.54,68.58
CLK3H  (via drill 0.33)
  Top 0.152: IC24.11 152.4,12.7 v152.4,47.62 152.4,53.98 v150.5,55.88
  Bottom 0.152: v152.4,47.62 154.31,49.53 IC33.8 | IC20.13 138.43,55.88 v150.5,55.88
CLK3L
  Top 0.152: IC23.11 139.06,12.06 139.06,47.62 IC20.10
  Bottom 0.152: IC33.6 153.67,53.34 145.41,53.34 142.88,50.8 138.43,50.8 IC20.10
CLK4H  (via drill 0.33)
  Top 0.152: v83.82,52.7 84.45,53.34 84.45,60.33 86.36,62.23 | IC25.11 86.36,62.23 | IC34.6 165.74,18.41 v165.74,4.45 | v92.08,6.99 93.34,8.26 93.34,10.16 92.08,11.43 89.53,11.43 89.53,50.8 88.9,51.44 88.9,59.69 86.36,62.23
  Bottom 0.152: IC35.4 79.38,52.7 v83.82,52.7 | v165.74,4.45 163.83,2.54 149.86,2.54 147.32,5.08 104.14,5.08 102.23,6.99 v92.08,6.99
CLK4L  (via drill 0.33)
  Top 0.152: v78.74,73.66 IC35.1 | v137.79,4.45 v140.97,7.62 | v114.3,4.45 107.95,10.79 107.95,45.09 107.31,45.72 107.31,61.59 104.78,64.14 v104.78,76.83
  Bottom 0.152: v78.74,73.66 81.28,76.2 93.98,76.2 95.25,77.47 | 95.25,77.47 96.52,78.74 IC10.11 | IC34.8 170.18,12.7 170.18,7.62 v140.97,7.62 | v114.3,4.45 v137.79,4.45 | v104.78,76.83 104.14,77.47 95.25,77.47
CLK5H  (via drill 0.33)
  Top 0.152: IC35.13 88.27,55.24 88.27,12.06 IC29.11 86.36,6.35 v88.9,3.81 | IC34.2 169.54,28.57 169.54,27.94 168.28,26.67 164.47,26.67 164.47,10.16 v156.21,1.91
  Bottom 0.152: v156.21,1.91 133.35,1.91 132.08,3.17 90.81,3.17 90.17,3.81 v88.9,3.81
CLK5L  (via drill 0.33)
  Top 0.152: IC28.11 97.16,8.26 97.16,4.45 | 97.16,4.45 95.89,4.45 95.89,19.68 95.25,20.32 95.25,34.29 92.71,36.83 92.71,43.18 93.98,44.45 v93.98,48.9 | IC34.4 165.1,22.86 v165.1,2.54 | 97.16,4.45 v99.69,1.91
  Bottom 0.152: v93.98,48.9 92.08,50.8 90.81,50.8 89.53,49.53 IC35.10 | v165.1,2.54 163.83,1.27 100.33,1.27 v99.69,1.91
CLK6H  (via drill 0.33)
  Top 0.152: v69.85,51.44 69.85,13.97 IC27.11 v75.56,8.26 | v151.76,50.8 151.76,43.81 149.22,41.27 149.22,36.2 147.32,34.29 v147.32,3.81
  Bottom 0.152: v69.85,51.44 69.22,52.07 IC38.4 | IC33.13 161.29,50.8 v151.76,50.8 | v147.32,3.81 104.78,3.81 102.23,6.35 77.47,6.35 v75.56,8.26
CLK6L  (via drill 0.33)
  Top 0.152: IC26.11 64.14,10.16 65.41,8.89 67.94,8.89 | 67.94,8.89 67.94,35.56 66.67,36.83 66.67,43.18 68.58,45.09 v68.58,59.05 | v87.63,40.01 85.09,37.47 85.09,33.66 81.92,30.48 81.92,7.62 80.64,6.35 67.94,6.35 67.94,8.89
  Bottom 0.152: v68.58,59.05 67.94,59.69 IC38.1 | IC33.11 157.48,39.37 132.72,39.37 132.08,40.01 v87.63,40.01
CLK7H  (via drill 0.33)
  Top 0.152: IC38.13 71.75,59.05 71.75,62.23 73.66,64.14 v73.66,67.31 IC31.11
  Bottom 0.152: IC33.17 161.29,60.96 151.76,60.96 145.41,67.31 v73.66,67.31
CLK7L  (via drill 0.33)
  Top 0.152: v67.94,50.16 67.94,62.87 66.67,64.14 v66.67,67.94 | v62.23,69.22 60.96,70.48 IC30.11 | v152.4,55.88 151.76,56.52 151.76,60.33 150.5,61.59 v150.5,63.5
  Bottom 0.152: IC38.10 73.03,50.16 v67.94,50.16 | v62.23,69.22 65.41,69.22 v66.67,67.94 146.05,67.94 v150.5,63.5 | IC33.15 161.29,55.88 v152.4,55.88
DATA0
  Top 0.152: IC9.2 24.77,47.62 24.77,53.34 25.4,53.98 25.4,58.42 IC7.2
  Bottom 0.152: X1.A19 6.35,64.77 10.79,64.77 13.34,62.23 13.97,62.23 18.41,57.78 22.23,57.78 IC7.2
DATA1  (via drill 0.33)
  Top 0.152: IC9.3 27.94,48.26 27.94,58.42 IC7.3 26.67,64.14 v26.04,64.77
  Bottom 0.152: X1.A20 6.35,67.31 19.68,67.31 21.59,69.22 24.13,69.22 25.4,67.94 25.4,64.77 v26.04,64.77
DATA2
  Top 0.152: IC9.4 29.84,47.62 29.84,53.34 30.48,53.98 30.48,58.42 IC7.4
  Bottom 0.152: X1.A21 3.81,67.31 3.81,65.41 1.27,62.87 1.27,49.53 16.51,49.53 20.95,45.09 27.3,45.09 IC9.4
DATA3  (via drill 0.33)
  Top 0.152: IC9.5 32.38,47.62 32.38,53.34 33.02,53.98 33.02,58.42 IC7.5 31.75,62.87 v31.11,63.5 | v17.14,70.48 18.41,69.22 v18.41,66.04
  Bottom 0.152: X1.A22 6.35,72.39 12.06,72.39 13.97,70.48 v17.14,70.48 | v18.41,66.04 20.95,63.5 v31.11,63.5
DATA4  (via drill 0.33)
  Top 0.152: IC9.6 35.56,48.26 35.56,58.42 IC7.6 | v14.61,71.12 15.24,70.48 v15.24,66.67
  Bottom 0.152: X1.A23 6.35,74.93 10.79,74.93 v14.61,71.12 | v15.24,66.67 20.32,66.67 22.86,64.14 34.29,64.14 35.56,62.87 38.1,62.87 40.64,60.33 40.64,57.78 36.2,57.78 IC7.6
DATA5  (via drill 0.33)
  Top 0.152: IC9.7 38.1,48.26 38.1,58.42 IC7.7 | v19.68,71.12 20.32,70.48 v20.32,61.59
  Bottom 0.152: X1.A24 6.35,77.47 10.79,77.47 11.43,76.83 11.43,74.93 12.06,74.93 15.88,71.12 v19.68,71.12 | v20.32,61.59 34.92,61.59 IC7.7
DATA6  (via drill 0.33)
  Top 0.152: IC9.8 40.01,47.62 40.01,53.34 40.64,53.98 40.64,58.42 IC7.8 | v12.06,80.01 12.7,79.38 v12.7,64.14
  Bottom 0.152: X1.A25 6.35,80.01 v12.06,80.01 | v12.7,64.14 15.88,60.96 18.41,60.96 19.68,62.23 36.83,62.23 IC7.8
DATA7  (via drill 0.33)
  Top 0.152: IC9.9 42.55,47.62 42.55,53.34 43.18,53.98 43.18,58.42 IC7.9 | X1.A26 1.91,78.11 v1.91,57.15
  Bottom 0.152: v1.91,57.15 4.45,54.61 19.68,54.61 22.23,57.15 40.64,57.15 41.91,58.42 IC7.9
DATA8
  Bottom 0.152: IC8.2 21.59,69.85 4.45,69.85 3.81,70.48 3.81,83.82 X1.A27
DATA9  (via drill 0.33)
  Top 0.152: IC8.3 27.3,73.03 27.3,78.74 27.94,79.38 v27.94,85.72
  Bottom 0.152: v27.94,85.72 26.67,87 19.05,87 17.14,85.09 6.35,85.09 X1.A28
DATA10  (via drill 0.33)
  Top 0.152: v15.24,73.03 15.24,85.72 13.34,87.63 5.08,87.63 X1.A29
  Bottom 0.152: IC8.4 27.3,74.3 19.05,74.3 17.78,73.03 v15.24,73.03
DATA11  (via drill 0.33)
  Top 0.152: v15.88,73.66 15.88,85.72 11.43,90.17 5.08,90.17 X1.A30
  Bottom 0.152: IC8.5 29.21,74.93 19.05,74.93 17.78,73.66 v15.88,73.66
DATA12  (via drill 0.33)
  Top 0.152: v12.06,76.2 10.79,74.93 6.35,74.93 6.35,73.03 6.99,72.39 8.26,72.39 8.89,71.75 8.89,70.48 8.26,69.85 6.99,69.85 6.35,69.22 6.35,65.41 5.71,64.77 3.81,64.77 3.81,27.3 4.45,26.67 8.89,26.67 8.89,24.13 X1.B3
  Bottom 0.152: IC8.6 30.48,76.2 v12.06,76.2
DATA13  (via drill 0.33)
  Top 0.152: IC8.7 37.47,73.03 v37.47,76.2 | v11.43,78.11 10.79,77.47 3.17,77.47 v3.17,69.85 | v3.17,66.04 3.17,25.4 4.45,24.13 7.62,24.13 X1.B4
  Bottom 0.152: v37.47,76.2 36.2,77.47 19.05,77.47 17.78,78.74 12.7,78.74 12.06,78.11 v11.43,78.11 | v3.17,66.04 v3.17,69.85
DATA14  (via drill 0.33)
  Top 0.152: IC8.8 40.01,73.03 40.01,78.74 40.64,79.38 v40.64,83.19 | v4.45,82.55 1.27,79.38 1.27,32.38 v1.91,31.75
  Bottom 0.152: v40.64,83.19 11.43,83.19 10.79,82.55 v4.45,82.55 | v1.91,31.75 4.45,29.21 6.35,29.21 X1.B5
DATA15  (via drill 0.33)
  Top 0.152: IC8.9 42.55,73.03 42.55,78.74 43.18,79.38 43.18,80.64 44.45,81.92 46.35,81.92 v46.35,66.67 | v50.16,66.04 50.16,60.96 49.53,60.33 49.53,44.45 48.9,43.81 v48.9,38.1
  Bottom 0.152: v46.35,66.67 46.99,66.04 v50.16,66.04 | v48.9,38.1 17.14,38.1 10.79,31.75 8.89,31.75 X1.B6
FP-ADATA0  (via drill 0.33)
  Top 0.152: IC12.18 165.1,30.48 165.1,57.78 167,59.69 v167,97.16
  Bottom 0.152: v167,97.16 170.18,100.33 JP6.3
FP-ADATA1  (via drill 0.33)
  Top 0.152: v169.54,26.67 170.18,27.3 170.18,35.56 168.91,36.83 v168.91,46.35 | v175.26,80.64 176.53,80.64 176.53,94.61 174.62,96.52 171.45,96.52 JP6.5
  Bottom 0.152: IC12.16 166.37,26.67 v169.54,26.67 | v168.91,46.35 176.53,53.98 176.53,80.64 v175.26,80.64
FP-ADATA2  (via drill 0.33)
  Top 0.152: v146.69,8.26 146.69,34.92 148.59,36.83 148.59,43.81 147.32,45.09 147.32,62.23 148.59,63.5 148.59,78.11 147.96,78.74 147.96,99.06 149.22,100.33 160.66,100.33 160.66,101.6 161.93,102.87 170.18,102.87 170.18,96.52 JP6.7
  Bottom 0.152: IC12.14 163.19,17.14 163.83,17.14 167,13.97 168.28,13.97 169.54,12.7 169.54,8.26 v146.69,8.26
FP-ADATA3  (via drill 0.33)
  Top 0.152: v168.28,11.43 172.09,15.24 172.09,34.92 173.99,36.83 v173.99,38.1 | v161.93,45.72 160.66,46.99 160.66,69.85 161.93,71.12 161.93,77.47 160.66,78.74 v160.66,91.44
  Bottom 0.152: IC12.12 163.83,11.43 v168.28,11.43 | v173.99,38.1 166.37,45.72 v161.93,45.72 | v160.66,91.44 161.93,92.71 JP6.9
FP-ADATA4  (via drill 0.33)
  Top 0.152: IC12.9 156.84,10.79 156.84,5.71 153.67,2.54 147.96,2.54 147.96,34.29 151.13,37.47 v151.13,41.91 | v155.57,43.18 156.84,44.45 156.84,70.48 156.21,71.12 156.21,78.11 158.75,80.64 v158.75,89.53
  Bottom 0.152: v151.13,41.91 152.4,43.18 v155.57,43.18 | v158.75,89.53 159.38,90.17 JP6.11
FP-ADATA5  (via drill 0.33)
  Top 0.152: IC12.7 159.38,22.23 v159.38,33.66 | v166.37,36.2 167.64,37.47 167.64,55.24 168.28,55.88 v168.28,79.38 | v170.18,80.64 170.81,81.28 172.72,81.28 172.72,86.36 JP6.13
  Bottom 0.152: v159.38,33.66 160.02,34.29 162.56,34.29 164.47,36.2 v166.37,36.2 | v168.28,79.38 169.54,80.64 v170.18,80.64
FP-ADATA6
  Top 0.152: IC12.5 157.48,25.4 157.48,35.56 156.21,36.83 156.21,43.18 158.12,45.09 158.12,70.48 159.38,71.75 159.38,97.79 161.93,100.33 169.54,100.33 169.54,87 JP6.15
FP-ADATA7  (via drill 0.33)
  Top 0.152: v158.12,27.94 158.75,28.57 v158.75,68.58 | v167.64,83.19 v167.64,77.47
  Bottom 0.152: v158.12,27.94 IC12.3 | v167.64,77.47 v158.75,68.58 | v167.64,83.19 170.81,83.19 JP6.17
FP-ADATA8
  Bottom 0.152: IC11.18 168.28,96.52 170.81,99.06 172.72,99.06 JP6.4
FP-ADATA9
  Bottom 0.152: IC11.16 172.09,91.44 172.72,92.08 172.72,97.79 JP6.6
FP-ADATA10  (via drill 0.33)
  Top 0.152: v173.35,86.36 172.72,87 172.72,93.98 JP6.8
  Bottom 0.152: v173.35,86.36 IC11.14
FP-ADATA11  (via drill 0.33)
  Top 0.152: v168.28,81.28 170.81,78.74 172.72,78.74 172.72,80.64 173.35,81.28 175.26,81.28 175.26,91.44 JP6.10
  Bottom 0.152: v168.28,81.28 IC11.12
FP-ADATA12
  Bottom 0.152: IC11.9 156.21,82.55 169.54,82.55 170.81,81.28 172.09,81.28 172.72,81.92 172.72,83.82 174.62,83.82 175.26,84.45 175.26,90.17 JP6.12
FP-ADATA13
  Bottom 0.152: IC11.7 156.21,87.63 169.54,87.63 170.81,88.9 172.72,88.9 JP6.14
FP-ADATA14  (via drill 0.33)
  Top 0.152: IC11.5 158.12,88.27 v158.12,87
  Bottom 0.152: v158.12,87 160.02,85.09 169.54,85.09 170.81,83.82 172.09,83.82 173.35,85.09 JP6.16
FP-ADATA15
  Bottom 0.152: IC11.3 156.21,97.79 167,97.79 170.81,101.6 174.62,101.6 175.9,100.33 175.9,82.55 JP6.18
FP-CLK0H  (via drill 0.33)
  Top 0.152: IC34.5 170.81,26.04 v170.81,34.92 | v164.47,65.41 v164.47,34.92
  Bottom 0.152: v164.47,34.92 v170.81,34.92 | v164.47,65.41 164.47,72.39 168.28,72.39 170.81,74.93 JP6.23
FP-CLK0L  (via drill 0.33)
  Top 0.152: IC34.3 165.74,29.84 v165.74,57.15 | v169.54,60.96 169.54,67.31 170.81,68.58 172.72,68.58 172.72,71.12 JP6.25
  Bottom 0.152: v169.54,60.96 v165.74,57.15
FP-CLK1H  (via drill 0.33)
  Top 0.152: v161.93,16.51 160.02,18.41 v160.02,34.92 | v161.93,36.2 161.93,43.18 160.02,45.09 160.02,69.85 161.29,71.12 v161.29,74.93
  Bottom 0.152: IC34.9 163.83,16.51 v161.93,16.51 | v160.02,34.92 161.29,36.2 v161.93,36.2 | v161.29,74.93 165.1,78.74 170.18,78.74 JP6.19
FP-CLK1L  (via drill 0.33)
  Top 0.152: v161.93,19.05 160.66,20.32 160.66,36.2 161.29,36.83 161.29,43.18 159.38,45.09 v159.38,67.94
  Bottom 0.152: IC34.7 166.37,19.05 v161.93,19.05 | v159.38,67.94 168.91,77.47 JP6.21
FP-CLK2H  (via drill 0.33)
  Top 0.152: v166.37,69.22 v166.37,60.33
  Bottom 0.152: IC33.16 165.74,60.33 v166.37,60.33 | v166.37,69.22 170.81,73.66 172.72,73.66 JP6.24
FP-CLK2L  (via drill 0.33)
  Top 0.152: v165.1,62.87 165.74,63.5 v165.74,66.04
  Bottom 0.152: IC33.18 163.19,62.87 v165.1,62.87 | v165.74,66.04 170.81,71.12 172.72,71.12 JP6.26
FP-CLK3H
  Bottom 0.152: IC33.12 163.19,47.62 169.54,47.62 175.9,53.98 175.9,80.01 JP6.20
FP-CLK3L  (via drill 0.33)
  Top 0.152: v167.64,73.03 v167.64,56.52
  Bottom 0.152: IC33.14 167,56.52 v167.64,56.52 | v167.64,73.03 170.81,76.2 172.72,76.2 JP6.22
FP-CLK4H
  Top 0.152: IC34.14 173.35,19.68 173.35,33.02 175.9,35.56 175.9,62.23 174.62,63.5 171.45,63.5 JP6.31
FP-CLK4L  (via drill 0.33)
  Top 0.152: v172.72,15.24 172.72,34.92 174.62,36.83 174.62,52.07 172.72,53.98 172.72,60.96 JP6.33
  Bottom 0.152: v172.72,15.24 IC34.12
FP-CLK5H  (via drill 0.33)
  Top 0.152: v169.54,32.38 169.54,35.56 168.28,36.83 168.28,53.98 168.91,54.61 168.91,67.31 JP6.27
  Bottom 0.152: IC34.18 170.81,32.38 v169.54,32.38
FP-CLK5L  (via drill 0.33)
  Top 0.152: v171.45,26.67 171.45,52.7 170.18,53.98 170.18,66.04 JP6.29
  Bottom 0.152: v171.45,26.67 IC34.16
FP-CLK6H
  Bottom 0.152: IC33.7 156.21,53.34 163.19,53.34 170.18,60.33 170.18,63.5 172.09,63.5 173.35,64.77 JP6.32
FP-CLK6L
  Bottom 0.152: IC33.9 156.21,48.26 169.54,48.26 175.26,53.98 175.26,62.23 JP6.34
FP-CLK7H
  Bottom 0.152: IC33.3 156.21,63.5 165.74,63.5 170.81,68.58 172.72,68.58 JP6.28
FP-CLK7L
  Bottom 0.152: IC33.5 156.21,58.42 163.19,58.42 170.81,66.04 172.72,66.04 JP6.30
GND  (via drill 0.33)
  Top 0.152: IC8.10 45.72,71.12 45.72,60.96 IC7.10 45.72,58.42 45.72,50.16 44.45,48.9 IC9.10 43.81,46.35 43.81,19.05 38.1,13.34 | PWR.K 167.64,3.81 IC34.10 | IC1.7 35.56,33.02 35.56,25.4 38.1,22.86 | IC3.8 38.1,22.86 | IC2.8 38.1,10.16 38.1,13.34 | 38.1,22.86 38.1,13.34 | v155.57,74.93 154.94,75.56 IC11.10 | IC25.10 83.82,73.66 C30.2 | JP6.39 172.72,53.34 C36.2 | C8.2 v134.62,43.18 C10.2 | X1.A1 X1.B1 X1.C1 | C15.2 19.05,15.24 19.05,25.4 C24.2 19.05,27.94 19.05,38.1 C19.2 17.78,48.26 16.51,49.53 16.51,53.34 | IC5.13 IC5.12 31.75,100.33 | IC5.4 IC5.5 31.75,100.33 | 35.56,99.06 34.29,100.33 IC5.9 | 35.56,99.06 IC5.7 | IC5.10 31.75,100.33 | IC6.7 35.56,86.36 35.56,99.06 | 16.51,53.34 C21.2 | 16.51,63.5 16.51,53.34 | C18.2 16.51,63.5 | 16.51,63.5 16.51,76.2 C7.2 16.51,78.74 16.51,88.9 C4.2 | X1.A32 X1.B32 X1.C32 10.16,102.87 C12.2 | C34.2 171.45,105.41 J1.2 | C5.2 C17.2
  Bottom 0.152: IC9.10 45.72,45.72 52.07,45.72 IC37.7 54.61,43.18 64.77,43.18 | 64.77,43.18 IC38.7 | 77.47,43.18 IC35.7 | 64.77,43.18 77.47,43.18 | 90.17,43.18 IC32.7 | 77.47,43.18 90.17,43.18 | 102.87,43.18 IC13.7 | 90.17,43.18 102.87,43.18 | 115.57,43.18 IC14.7 | 102.87,43.18 115.57,43.18 | 128.27,43.18 IC20.7 | 115.57,43.18 128.27,43.18 | 128.27,43.18 v134.62,43.18 140.97,43.18 IC19.7 143.51,45.72 150.5,45.72 151.13,45.09 154.31,45.09 IC33.10 | 140.97,8.89 130.81,8.89 IC23.10 128.27,8.89 121.92,8.89 120.65,10.16 IC18.10 115.57,11.43 109.22,11.43 107.95,10.16 IC17.10 102.87,11.43 96.52,11.43 95.25,10.16 IC28.10 90.17,8.89 77.47,8.89 | IC24.10 140.97,8.89 | 153.67,8.89 IC12.10 | 140.97,8.89 153.67,8.89 | IC34.10 166.37,8.89 153.67,8.89 | IC2.8 52.07,8.89 IC26.10 55.24,8.26 64.14,8.26 IC27.10 67.31,8.89 77.47,8.89 | IC29.10 77.47,8.89 | 140.97,80.01 IC22.10 | 140.97,80.01 130.81,80.01 IC21.10 128.27,77.47 118.11,77.47 IC16.10 116.2,79.38 113.03,79.38 112.39,80.01 111.12,80.01 109.86,78.74 IC15.10 102.87,80.01 96.52,80.01 95.25,78.74 IC10.10 90.17,77.47 80.01,77.47 IC25.10 75.56,78.74 74.3,80.01 67.31,80.01 IC31.10 64.77,77.47 54.61,77.47 IC30.10 | IC11.10 154.31,79.38 151.13,79.38 150.5,80.01 140.97,80.01 | C35.2 156.21,74.93 v155.57,74.93 | C29.2 59.05,62.87 67.94,62.87 68.58,62.23 69.85,62.23 C31.2 72.39,62.23 85.09,62.23 | 95.25,62.23 C28.2 | 85.09,62.23 95.25,62.23 | C30.2 85.09,62.23 | 107.95,62.23 C6.2 | 95.25,62.23 107.95,62.23 | 120.65,62.23 C20.2 | 107.95,62.23 120.65,62.23 | 133.35,62.23 C10.2 | 120.65,62.23 133.35,62.23 | C17.2 146.05,62.23 133.35,62.23 | C32.2 59.69,35.56 69.85,35.56
  Bottom 0.152: C33.2 69.85,35.56 | 82.55,35.56 C3.2 | 69.85,35.56 82.55,35.56 | 82.55,35.56 95.25,35.56 C2.2 97.16,36.2 106.05,36.2 106.68,35.56 110.49,35.56 | JP6.40 JP6.39 | 110.49,35.56 C23.2 | 120.65,35.56 110.49,35.56 | C22.2 120.65,35.56 | 133.35,35.56 C8.2 | 120.65,35.56 133.35,35.56 | 146.05,35.56 C9.2 | 133.35,35.56 146.05,35.56 | 146.05,35.56 158.75,35.56 C37.2 167,36.83 168.28,35.56 171.45,35.56 C36.2 | C15.2 13.97,17.78 X1.C1 | IC6.7 38.1,86.36 IC4.7 | IC5.10 IC5.9 36.2,103.5 45.09,103.5 C11.2 48.26,104.14 57.15,104.14 | C4.2 11.43,96.52 X1.C32 | IC5.13 21.59,102.87 C12.2 | C25.2 57.15,104.14 | 69.85,104.14 C26.2 | 57.15,104.14 69.85,104.14 | 82.55,104.14 C27.2 | 69.85,104.14 82.55,104.14 | 95.25,104.14 C1.2 | 82.55,104.14 95.25,104.14 | 95.25,104.14 107.95,104.14 C13.2 110.49,106.68 120.65,106.68 | 120.65,106.68 C14.2 | 133.35,106.68 C16.2 | 120.65,106.68 133.35,106.68 | 133.35,106.68 146.05,106.68 C5.2 148.59,104.14 158.75,104.14 C34.2
H/L-SWAP  (via drill 0.33)
  Top 0.152: v17.14,44.45 16.51,45.09 16.51,48.9 15.88,49.53 15.88,71.12 14.61,72.39 14.61,85.72 13.97,86.36 11.43,86.36 11.43,80.01 X1.C25 | IC6.10 31.11,92.08 31.11,86.36 30.48,85.72 v30.48,82.55
  Bottom 0.152: IC1.13 21.59,44.45 v17.14,44.45 | v30.48,82.55 29.84,81.92 15.24,81.92 12.06,78.74 X1.C25
N$1
  Top 0.152: IC13.3 106.05,56.52 106.05,62.23 104.14,64.14 104.14,76.83 102.23,78.74 102.23,99.69 IC15.1
N$2
  Bottom 0.152: IC4.8 48.26,87.63 32.38,87.63 27.94,92.08 27.94,95.89 18.41,95.89 5.08,109.22 5.08,112.39 6.99,112.39 JP1.3
N$3
  Top 0.152: IC4.3 IC4.4
N$4
  Top 0.152: IC4.6 38.1,92.71 38.1,102.23 35.56,104.78 35.56,106.05 29.21,112.39 3.81,112.39 JP1.1
N$5
  Bottom 0.152: IC6.11 31.11,90.81 34.29,90.81 35.56,92.08 35.56,95.25 48.26,95.25 IC4.12
N$6
  Top 0.152: IC6.6 33.66,85.72 33.66,91.44 33.02,92.08 33.02,106.05 28.57,110.49 JP2.3
N$7  (via drill 0.33)
  Top 0.152: IC4.11 43.81,99.69 43.81,101.6 v36.83,108.58
  Bottom 0.152: v36.83,108.58 15.88,108.58 JP2.1
N$8
  Top 0.152: IC11.1 154.94,107.95 R1.1 J1.1 | IC33.19 164.47,66.67 164.47,97.16 IC11.19 | IC12.1 153.03,34.92 153.03,65.41 IC33.1
  Bottom 0.152: IC12.1 157.48,30.48 IC12.19 165.1,30.48 IC34.1 172.72,33.02 IC34.19 | IC33.19 161.29,66.04 156.21,66.04 IC33.1 | IC11.19 160.02,101.6 IC11.1
N$9
  Bottom 0.152: R3.1 165.1,5.08 173.99,5.08 PWR.A
N$10